# EAGLE design drive-sys-board-rev2 (EAGLE 6.5.0)
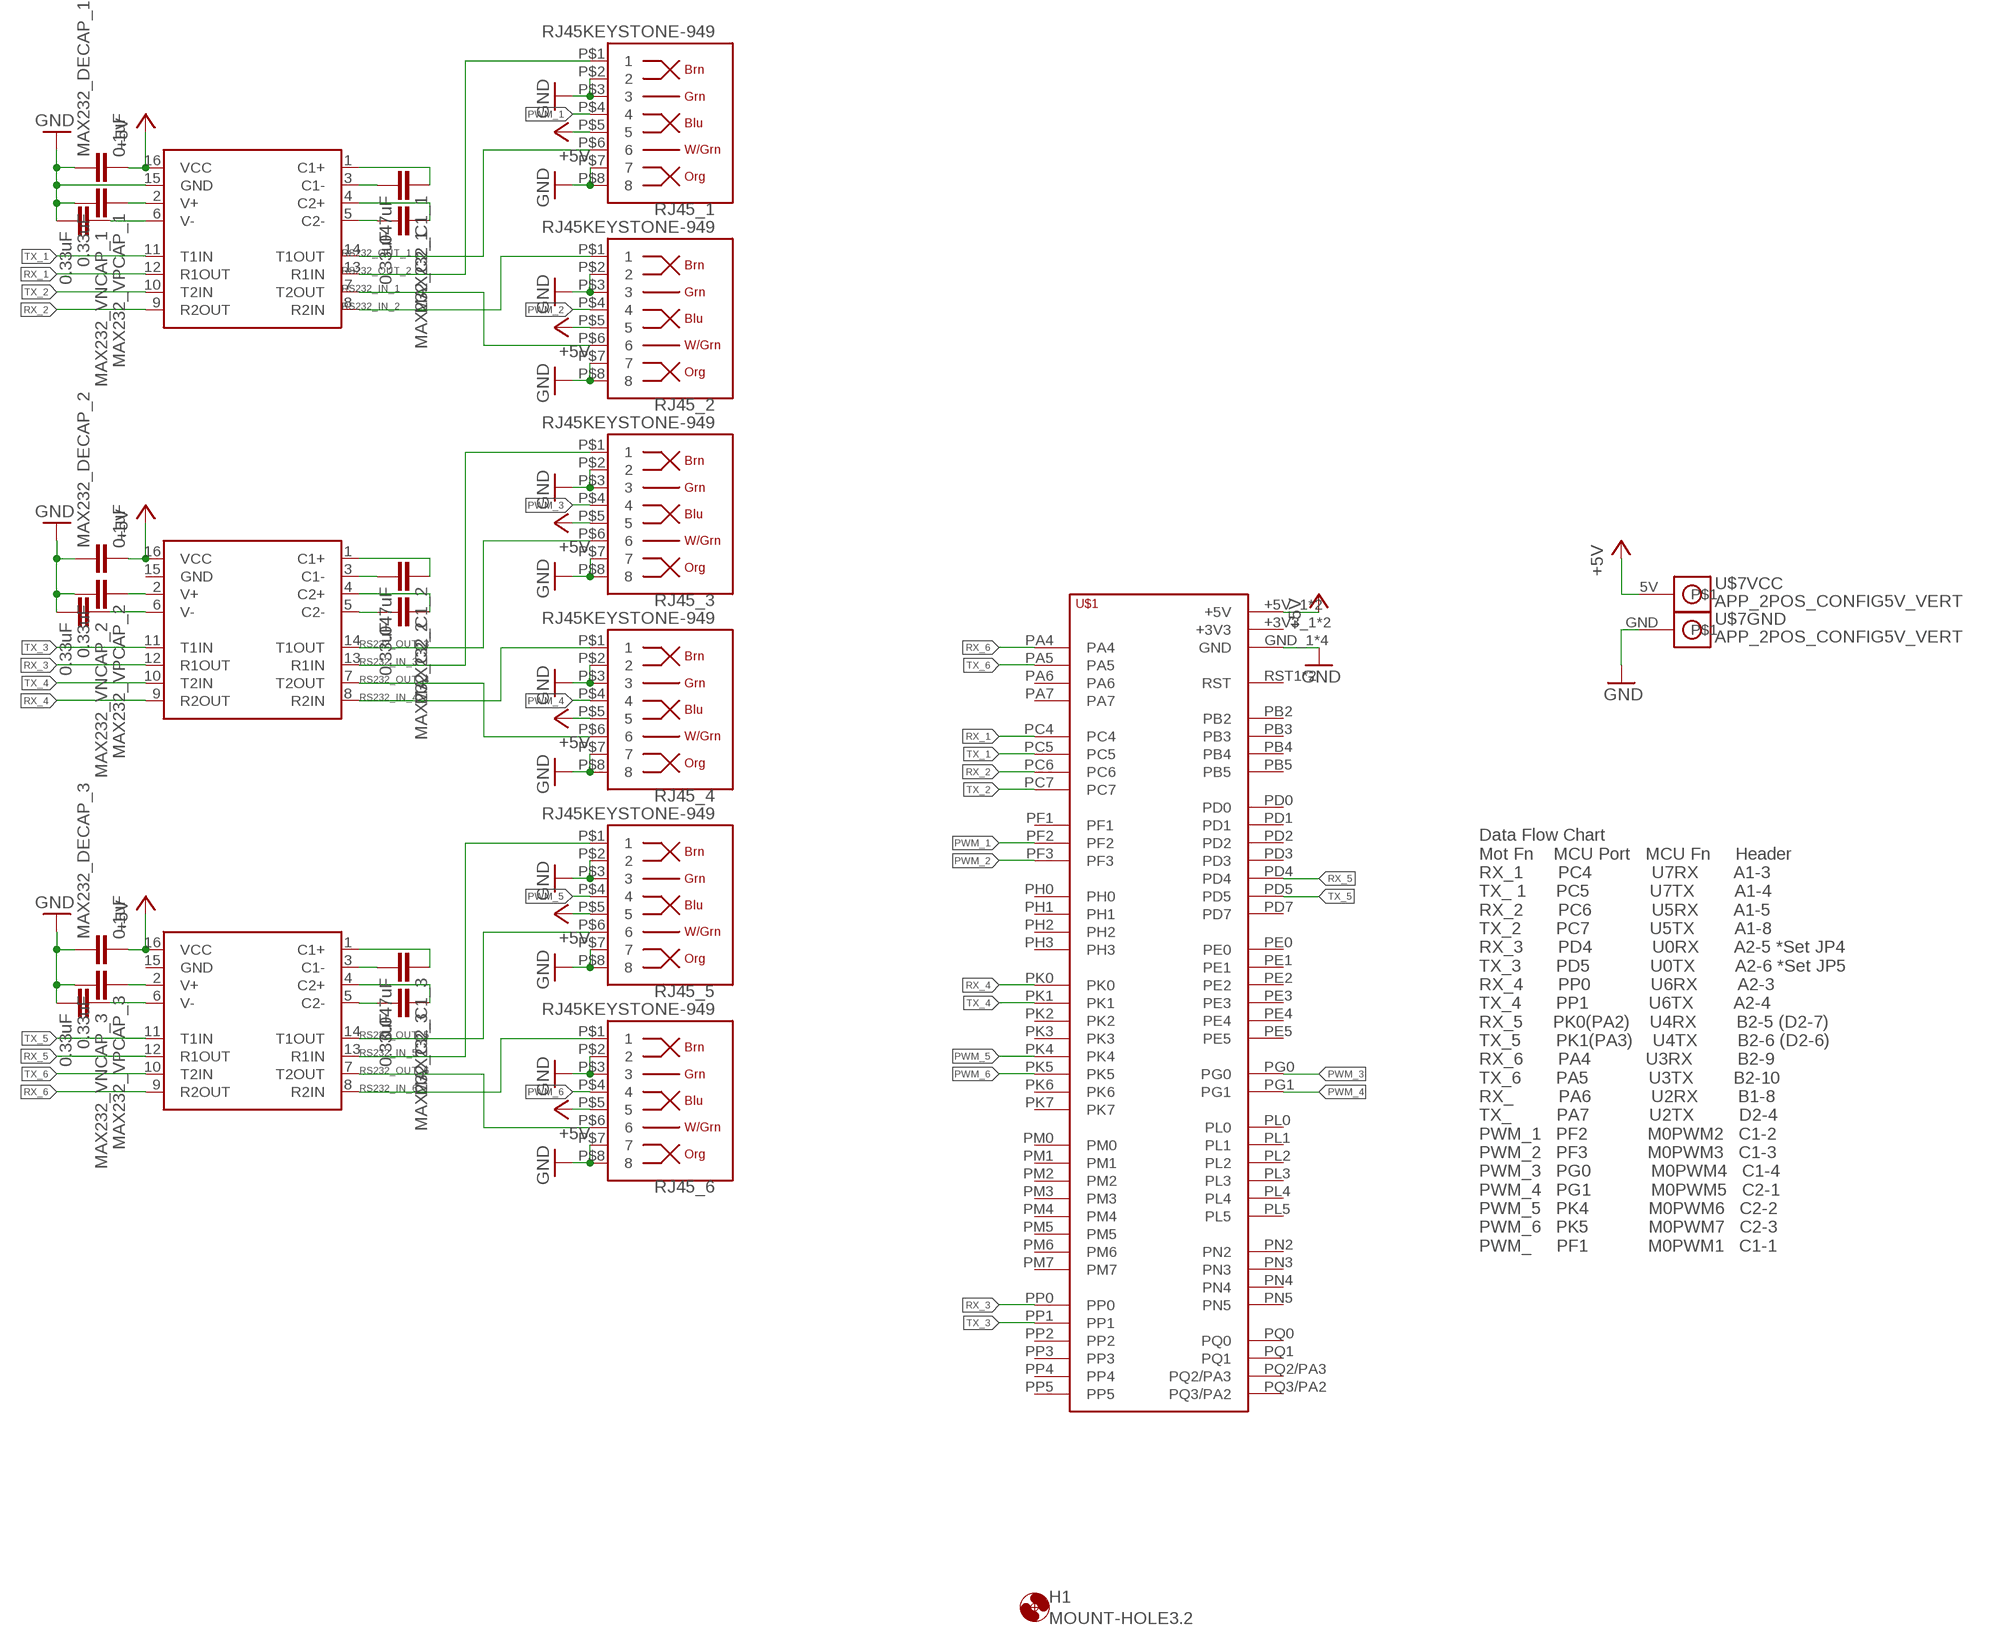
[diagram p0: schematic, sheet 1]

## Parts
H1  MOUNT-HOLE3.2  [3,2]
MAX232_1  MAX3232SO16  [SO16]
MAX232_2  MAX3232SO16  [SO16]
MAX232_3  MAX3232SO16  [SO16]
MAX232_C1_1  .047uF  CAP1206  [1206]
MAX232_C1_2  .047uF  CAP1206  [1206]
MAX232_C1_3  0.047uF  CAP1206  [1206]
MAX232_C2_1  0.33uF  CAP1206  [1206]
MAX232_C2_2  0.33uF  CAP1206  [1206]
MAX232_C2_3  0.33uF  CAP1206  [1206]
MAX232_DECAP_1  0.1uF  CAP1206  [1206]
MAX232_DECAP_2  0.1uF  CAP1206  [1206]
MAX232_DECAP_3  0.1uF  CAP1206  [1206]
MAX232_VNCAP_1  0.33uF  CAP1206  [1206]
MAX232_VNCAP_2  0.33uF  CAP1206  [1206]
MAX232_VNCAP_3  0.33uF  CAP1206  [1206]
MAX232_VPCAP_1  0.33uF  CAP1206  [1206]
MAX232_VPCAP_2  0.33uF  CAP1206  [1206]
MAX232_VPCAP_3  0.33uF  CAP1206  [1206]
RJ45_1  RJ45KEYSTONE-949  [KEYSTONE-949]
RJ45_2  RJ45KEYSTONE-949  [KEYSTONE-949]
RJ45_3  RJ45KEYSTONE-949  [KEYSTONE-949]
RJ45_4  RJ45KEYSTONE-949  [KEYSTONE-949]
RJ45_5  RJ45KEYSTONE-949  [KEYSTONE-949]
RJ45_6  RJ45KEYSTONE-949  [KEYSTONE-949]
U$1  TIVA-C-CONNECTED  [TIVA-C-CONNECTED]
U$7  APP_2POS_CONFIG5V_VERT  [APP45_5V_VERT_CONFIG]

## Nets
+5V: MAX232_1.16(VCC) MAX232_2.16(VCC) MAX232_3.16(VCC) MAX232_DECAP_1.2 MAX232_DECAP_2.2 MAX232_DECAP_3.2 RJ45_1.P$5 RJ45_2.P$5 RJ45_3.P$5 RJ45_4.P$5 RJ45_5.P$5 RJ45_6.P$5 U$1.+5V_1(+5V) U$1.+5V_2(+5V) U$7.5V
GND: MAX232_1.15(GND) MAX232_DECAP_1.1 MAX232_DECAP_2.1 MAX232_DECAP_3.1 MAX232_VNCAP_1.2 MAX232_VNCAP_2.2 MAX232_VNCAP_3.2 MAX232_VPCAP_1.2 MAX232_VPCAP_2.2 MAX232_VPCAP_3.2 RJ45_1.P$2 RJ45_1.P$3 RJ45_1.P$7 RJ45_1.P$8 RJ45_2.P$2 RJ45_2.P$3 RJ45_2.P$7 RJ45_2.P$8 RJ45_3.P$2 RJ45_3.P$3 RJ45_3.P$7 RJ45_3.P$8 RJ45_4.P$2 RJ45_4.P$3 RJ45_4.P$7 RJ45_4.P$8 RJ45_5.P$2 RJ45_5.P$3 RJ45_5.P$7 RJ45_5.P$8 RJ45_6.P$2 RJ45_6.P$3 RJ45_6.P$7 RJ45_6.P$8 U$1.GND_1(GND) U$1.GND_2(GND) U$1.GND_3(GND) U$1.GND_4(GND) U$7.GND
N$1_1: MAX232_1.1(C1+) MAX232_C1_1.1
N$1_2: MAX232_2.1(C1+) MAX232_C1_2.1
N$1_3: MAX232_3.1(C1+) MAX232_C1_3.1
N$2_1: MAX232_1.2(V+) MAX232_VPCAP_1.1
N$2_2: MAX232_2.2(V+) MAX232_VPCAP_2.1
N$2_3: MAX232_3.2(V+) MAX232_VPCAP_3.1
N$3_1: MAX232_1.3(C1-) MAX232_C1_1.2
N$3_2: MAX232_2.3(C1-) MAX232_C1_2.2
N$3_3: MAX232_3.3(C1-) MAX232_C1_3.2
N$4_1: MAX232_1.4(C2+) MAX232_C2_1.1
N$4_2: MAX232_2.4(C2+) MAX232_C2_2.1
N$4_3: MAX232_3.4(C2+) MAX232_C2_3.1
N$5_1: MAX232_1.5(C2-) MAX232_C2_1.2
N$5_2: MAX232_2.5(C2-) MAX232_C2_2.2
N$5_3: MAX232_3.5(C2-) MAX232_C2_3.2
N$6_1: MAX232_1.6(V-) MAX232_VNCAP_1.1
N$6_2: MAX232_2.6(V-) MAX232_VNCAP_2.1
N$6_3: MAX232_3.6(V-) MAX232_VNCAP_3.1
PWM_1: RJ45_1.P$4 U$1.PF2
PWM_2: RJ45_2.P$4 U$1.PF3
PWM_3: RJ45_3.P$4 U$1.PG0
PWM_4: RJ45_4.P$4 U$1.PG1
PWM_5: RJ45_5.P$4 U$1.PK4
PWM_6: RJ45_6.P$4 U$1.PK5
RS232_IN_1: MAX232_1.13(R1IN) RJ45_1.P$1
RS232_IN_2: MAX232_1.8(R2IN) RJ45_2.P$1
RS232_IN_3: MAX232_2.13(R1IN) RJ45_3.P$1
RS232_IN_4: MAX232_2.8(R2IN) RJ45_4.P$1
RS232_IN_5: MAX232_3.13(R1IN) RJ45_5.P$1
RS232_IN_6: MAX232_3.8(R2IN) RJ45_6.P$1
RS232_OUT_1: MAX232_1.14(T1OUT) RJ45_1.P$6
RS232_OUT_2: MAX232_1.7(T2OUT) RJ45_2.P$6
RS232_OUT_3: MAX232_2.14(T1OUT) RJ45_3.P$6
RS232_OUT_4: MAX232_2.7(T2OUT) RJ45_4.P$6
RS232_OUT_5: MAX232_3.14(T1OUT) RJ45_5.P$6
RS232_OUT_6: MAX232_3.7(T2OUT) RJ45_6.P$6
RX_1: MAX232_1.12(R1OUT) U$1.PC4
RX_2: MAX232_1.9(R2OUT) U$1.PC6
RX_3: MAX232_2.12(R1OUT) U$1.PP0
RX_4: MAX232_2.9(R2OUT) U$1.PK0
RX_5: MAX232_3.12(R1OUT) U$1.PD4
RX_6: MAX232_3.9(R2OUT) U$1.PA4
TX_1: MAX232_1.11(T1IN) U$1.PC5
TX_2: MAX232_1.10(T2IN) U$1.PC7
TX_3: MAX232_2.11(T1IN) U$1.PP1
TX_4: MAX232_2.10(T2IN) U$1.PK1
TX_5: MAX232_3.11(T1IN) U$1.PD5
TX_6: MAX232_3.10(T2IN) U$1.PA5
Unconnected: MAX232_2.15(GND) MAX232_3.15(GND) U$1.+3V3_1(+3V3) U$1.+3V3_2(+3V3) U$1.PA6 U$1.PA7 U$1.PB2 U$1.PB3 U$1.PB4 U$1.PB5 U$1.PD0 U$1.PD1 U$1.PD2 U$1.PD3 U$1.PD7 U$1.PE0 U$1.PE1 U$1.PE2 U$1.PE3 U$1.PE4 U$1.PE5 U$1.PF1 U$1.PH0 U$1.PH1 U$1.PH2 U$1.PH3 U$1.PK2 U$1.PK3 U$1.PK6 U$1.PK7 U$1.PL0 U$1.PL1 U$1.PL2 U$1.PL3 U$1.PL4 U$1.PL5 U$1.PM0 U$1.PM1 U$1.PM2 U$1.PM3 U$1.PM4 U$1.PM5 U$1.PM6 U$1.PM7 U$1.PN2 U$1.PN3 U$1.PN4 U$1.PN5 U$1.PP2 U$1.PP3 U$1.PP4 U$1.PP5 U$1.PQ0 U$1.PQ1 U$1.PQ2/PA3 U$1.PQ3/PA2 U$1.RST1(RST) U$1.RST_2(RST)

## Notes on the sheet
- Data Flow Chart
  Mot Fn    MCU Port   MCU Fn     Header
  RX_1       PC4            U7RX       A1-3
  TX_ 1      PC5            U7TX        A1-4
  RX_2       PC6            U5RX       A1-5
  TX_2       PC7            U5TX        A1-8
  RX_3       PD4            U0RX       A2-5 *Set JP4
  TX_3       PD5            U0TX        A2-6 *Set JP5
  RX_4       PP0            U6RX        A2-3 
  TX_4       PP1            U6TX        A2-4
  RX_5      PK0(PA2)    U4RX        B2-5 (D2-7)
  TX_5       PK1(PA3)    U4TX        B2-6 (D2-6)
  RX_6       PA4           U3RX         B2-9
  TX_6       PA5            U3TX        B2-10
  RX_         PA6            U2RX        B1-8
  TX_         PA7            U2TX         D2-4
  PWM_1   PF2            M0PWM2   C1-2
  PWM_2   PF3            M0PWM3   C1-3
  PWM_3   PG0            M0PWM4   C1-4
  PWM_4   PG1            M0PWM5   C2-1
  PWM_5   PK4            M0PWM6   C2-2
  PWM_6   PK5            M0PWM7   C2-3
  PWM_     PF1            M0PWM1   C1-1

## Library data of the parts
H1 = holes:MOUNT-HOLE: MOUNTING HOLE with drill center marker
MAX232_1-MAX232_3 = MRDT-Digital-ICs:MAX3232: MAX3232 RS232 Transceiver http://pdfserv.maximintegrated.com/en/ds/MAX3222-MAX3241.pdf
MAX232_C1_1-MAX232_C1_3 MAX232_C2_1-MAX232_C2_3 MAX232_DECAP_1-MAX232_DECAP_3 MAX232_VNCAP_1-MAX232_VNCAP_3 MAX232_VPCAP_1-MAX232_VPCAP_3 = SparkFun-Capacitors:CAP: Capacitor Standard 0603 ceramic capacitor, and 0.1" leaded capacitor.
RJ45_1-RJ45_6 = MRDT-2015-General:RJ45
U$1 = MRDT-2015-General:TIVA-C-CONNECTED: TIVA C CONNECTED LAUNCHPAD
U$7 = MRDT-Connectors:APP_2POS_CONFIG; COLOR1: RED; COLOR2: BLACK

## Board
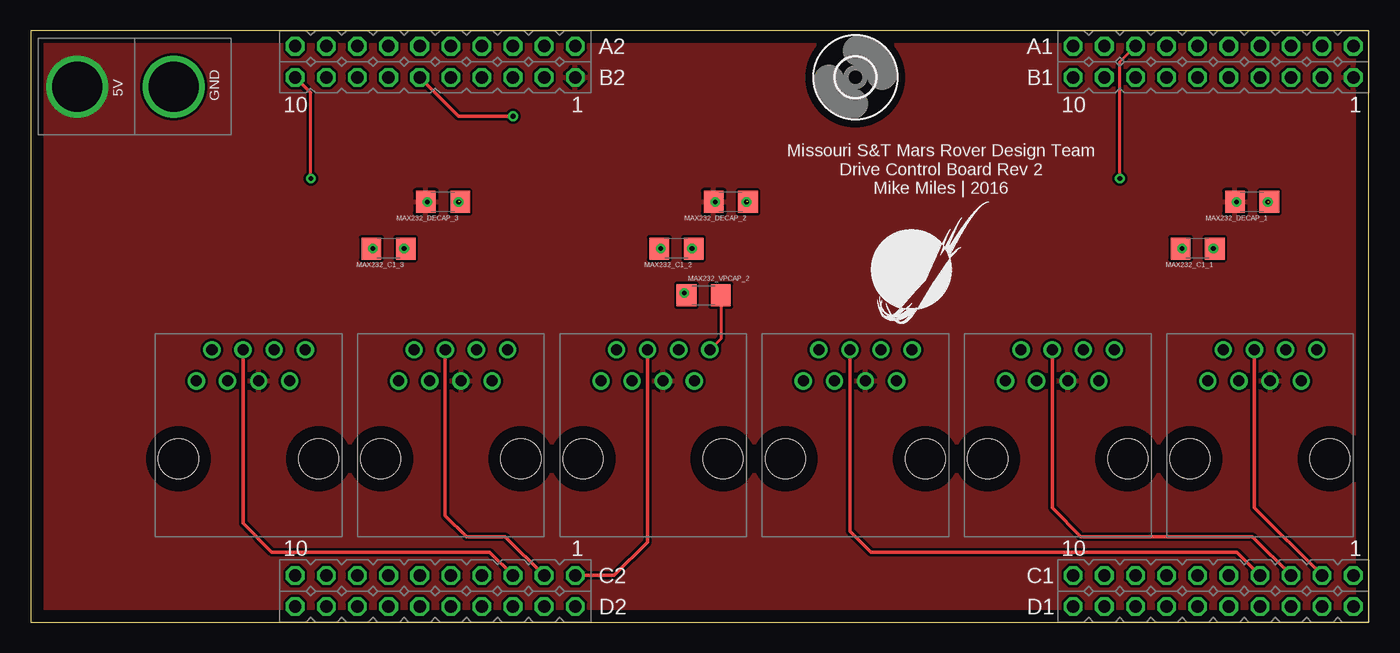
[diagram p1: board, top side]
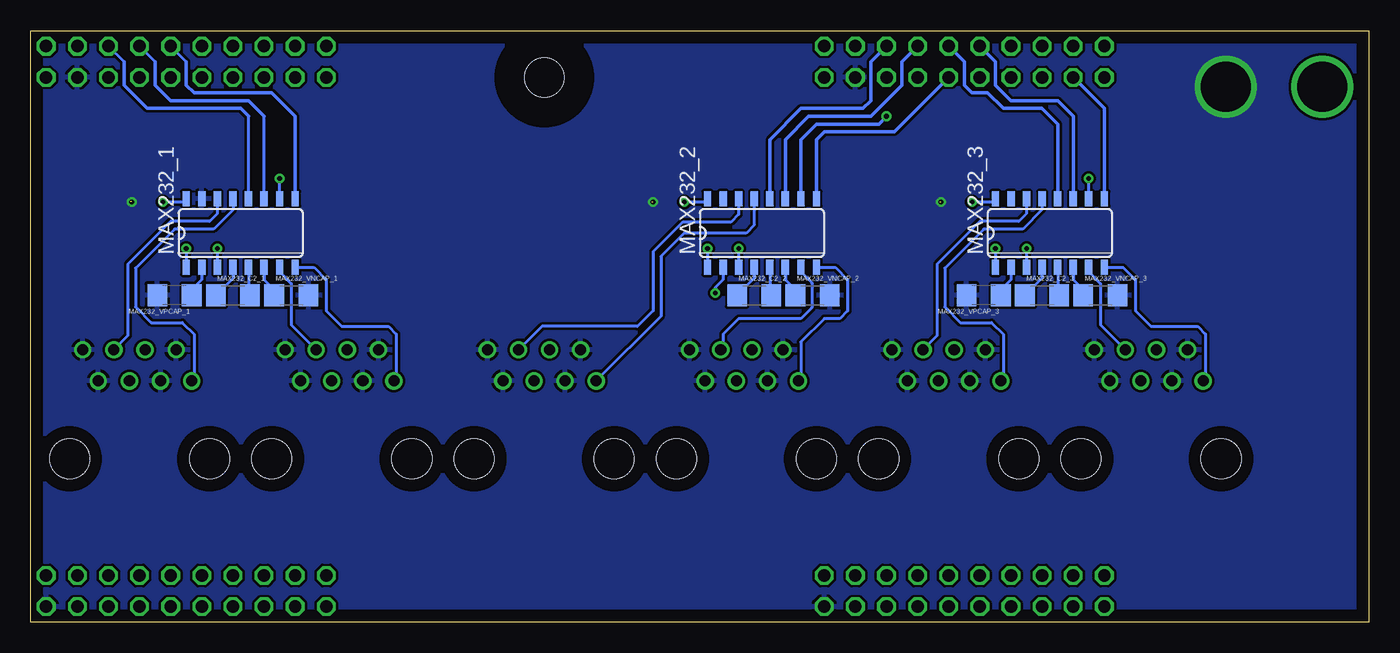
[diagram p2: board, bottom side, seen from below]

Size 109.22 x 48.26 mm. Coordinates in mm from the lower left corner, seen from the top.
Outline: 0,0 109.22,0 109.22,48.26 0,48.26 0,0
Copper layers (1*16): Top 0.035mm / dielectric 1.5mm / Bottom 0.035mm
Design rules "default *": minimum track width 10mil, minimum drill 15mil, track to track 8mil, track to pad 8mil, pad to pad 8mil, via to via 8mil, smd to smd 8mil, copper to edge 40mil, drill to drill 8mil, minimum pad ring 10mil, minimum via ring 8mil, stop-mask expansion 4mil, vias tented up to drill 0mil, thermal gap 10mil

### Footprints (pad centres in the part's own frame; a part is rotated, then mirrored left to right if it is on the bottom)
3,2 = hole 3.2: 0,0
SO16 = smd 0.6 x 1.2: 1 -4.445,-2.8; 2 -3.175,-2.8; 3 -1.905,-2.8; 4 -0.635,-2.8; 5 0.635,-2.8; 6 1.905,-2.8; 7 3.175,-2.8; 8 4.445,-2.8; 9 4.445,2.8; 10 3.175,2.8; 11 1.905,2.8; 12 0.635,2.8; 13 -0.635,2.8; 14 -1.905,2.8; 15 -3.175,2.8; 16 -4.445,2.8
1206 = smd 1.6 x 1.8: 1 -1.4,0; 2 1.4,0
KEYSTONE-949 = drill 0.9: P$1 1.46,6.35; P$2 2.731,8.89; P$3 4,6.35; P$4 5.271,8.89; P$5 6.54,6.35; P$6 7.811,8.89; P$7 9.081,6.35; P$8 10.351,8.89 | hole 3.251: 0,0; 11.43,0
TIVA-C-CONNECTED = drill 1.016 octagon: +3V3_1 59.69,54.61; +3V3_2 123.19,54.61; +5V_1 59.69,52.07; +5V_2 123.19,52.07; GND_1 57.15,52.07; GND_2 59.69,8.89; GND_3 120.65,52.07; GND_4 123.19,8.89; PA4 39.37,52.07; PA5 36.83,52.07; PA6 105.41,52.07; PA7 52.07,8.89; PB2 102.87,54.61; PB3 100.33,54.61; PB4 54.61,52.07; PB5 52.07,52.07; PC4 118.11,54.61; PC5 115.57,54.61; PC6 113.03,54.61; PC7 105.41,54.61; PD0 107.95,8.89; PD1 110.49,8.89; PD2 57.15,54.61; PD3 107.95,54.61; PD4 49.53,54.61; PD5 46.99,54.61; PD7 107.95,52.07; PE0 118.11,52.07; PE1 115.57,52.07; PE2 113.03,52.07; PE3 110.49,52.07; PE4 120.65,54.61; PE5 110.49,54.61; PF1 123.19,11.43; PF2 120.65,11.43; PF3 118.11,11.43; PG0 115.57,11.43; PG1 59.69,11.43; PH0 44.45,11.43; PH1 41.91,11.43; PH2 118.11,8.89; PH3 115.57,8.89; PK0 49.53,52.07; PK1 46.99,52.07; PK2 44.45,52.07; PK3 41.91,52.07; PK4 57.15,11.43; PK5 54.61,11.43; PK6 39.37,11.43; PK7 36.83,11.43; PL0 107.95,11.43; PL1 105.41,11.43; PL2 102.87,11.43; PL3 100.33,11.43; PL4 113.03,11.43; PL5 110.49,11.43; PM0 52.07,11.43; PM1 49.53,11.43; PM2 46.99,11.43; PM3 120.65,8.89; PM4 102.87,52.07; PM5 100.33,52.07; PM6 36.83,8.89; PM7 57.15,8.89; PN2 105.41,8.89; PN3 102.87,8.89; PN4 36.83,54.61; PN5 39.37,54.61; PP0 54.61,54.61; PP1 52.07,54.61; PP2 100.33,8.89; PP3 41.91,8.89; PP4 41.91,54.61; PP5 54.61,8.89; PQ0 44.45,54.61; PQ1 39.37,8.89; PQ2/PA3 46.99,8.89; PQ3/PA2 44.45,8.89; RST1 49.53,8.89; RST_2 113.03,8.89
APP45_5V_VERT_CONFIG = drill 4.064: 5V 3.937,12.573; GND 3.937,4.699

### Placement (x,y rotation side)
H1  67.31,44.45 0 top
MAX232_1  92.08,31.75 0 bottom
MAX232_2  49.53,31.75 0 bottom
MAX232_3  26.04,31.75 0 bottom
MAX232_C1_1  95.25,30.48 180 top
MAX232_C1_2  52.7,30.48 180 top
MAX232_C1_3  29.21,30.48 180 top
MAX232_C2_1  92.71,26.67 0 bottom
MAX232_C2_2  50.16,26.67 0 bottom
MAX232_C2_3  26.67,26.67 0 bottom
MAX232_DECAP_1  99.69,34.29 180 top
MAX232_DECAP_2  57.15,34.29 180 top
MAX232_DECAP_3  33.66,34.29 180 top
MAX232_VNCAP_1  87.95,26.67 0 bottom
MAX232_VNCAP_2  45.4,26.67 0 bottom
MAX232_VNCAP_3  21.91,26.67 0 bottom
MAX232_VPCAP_1  97.47,26.67 180 bottom
MAX232_VPCAP_2  54.93,26.67 0 top
MAX232_VPCAP_3  31.43,26.67 180 bottom
RJ45_1  94.61,13.34 0 top
RJ45_2  78.11,13.34 0 top
RJ45_3  61.59,13.34 0 top
RJ45_4  45.09,13.34 0 top
RJ45_5  28.57,13.34 0 top
RJ45_6  12.06,13.34 0 top
U$1  -15.24,-7.62 0 top
U$2  [MRDT_LOGO]  68.58,23.5 0 top
U$7  16.38,39.75 90 top

### Tracks (layer width: path | path; a pad name or v marks a point on that pad's centre or on a via)
+5V  (via drill 0.38)
  Top 0.254: MAX232_DECAP_1.2 v98.42,34.29 | MAX232_DECAP_2.2 v55.88,34.29 | MAX232_DECAP_3.2 v32.38,34.29
  Bottom 0.254: v98.42,34.29 96.78,34.29 MAX232_1.16 | v55.88,34.29 54.23,34.29 MAX232_2.16 | v32.38,34.29 30.74,34.29 MAX232_3.16
  pour Top: -1.27,52.7 -1.27,-1.27 116.2,-1.27 116.2,52.7
GND  (via drill 0.38)  (3 unrouted)
  Top 0.254: MAX232_VPCAP_2.2 56.33,23.12 RJ45_4.P$8
  other vias: 100.97,34.29 58.42,34.29 34.92,34.29
  pour Bottom: -5.08,49.53 -5.08,-3.81 111.12,-4.45 111.12,49.53
N$1  (via drill 0.38)
  other vias: 98.42,34.29
N$1_1  (via drill 0.38)
  Top 0.254: MAX232_C1_1.1 v96.52,30.48
  Bottom 0.254: v96.52,30.48 MAX232_1.1
N$1_2  (via drill 0.38)
  Top 0.254: MAX232_C1_2.1 v53.98,30.48
  Bottom 0.254: v53.98,30.48 MAX232_2.1
N$1_3  (via drill 0.38)
  Top 0.254: MAX232_C1_3.1 v30.48,30.48
  Bottom 0.254: v30.48,30.48 MAX232_3.1
N$2_1
  Bottom 0.254: MAX232_1.2 95.25,27.94 95.89,27.3 95.89,26.86 MAX232_VPCAP_1.1
N$2_2  (via drill 0.38)
  Top 0.254: v53.34,26.86 MAX232_VPCAP_2.1
  Bottom 0.254: MAX232_2.2 52.7,27.94 53.34,27.3 v53.34,26.86
N$2_3
  Bottom 0.254: MAX232_3.2 29.21,27.94 29.84,27.3 29.84,26.86 MAX232_VPCAP_3.1
N$3  (via drill 0.38)
  other vias: 32.38,34.29
N$3_1  (via drill 0.38)
  Top 0.254: MAX232_C1_1.2 v93.98,30.48
  Bottom 0.254: v93.98,30.48 MAX232_1.3
N$3_2  (via drill 0.38)
  Top 0.254: MAX232_C1_2.2 v51.44,30.48
  Bottom 0.254: v51.44,30.48 MAX232_2.3
N$3_3  (via drill 0.38)
  Top 0.254: MAX232_C1_3.2 v27.94,30.48
  Bottom 0.254: v27.94,30.48 MAX232_3.3
N$4_1
  Bottom 0.254: MAX232_1.4 92.71,28.07 MAX232_C2_1.1
N$4_2
  Bottom 0.254: MAX232_2.4 50.16,28.07 MAX232_C2_2.1
N$4_3
  Bottom 0.254: MAX232_3.4 26.67,28.07 MAX232_C2_3.1
N$5_1
  Bottom 0.254: MAX232_1.5 91.44,26.8 MAX232_C2_1.2
N$5_2
  Bottom 0.254: MAX232_2.5 48.9,26.8 MAX232_C2_2.2
N$5_3
  Bottom 0.254: MAX232_3.5 25.4,26.8 MAX232_C2_3.2
N$6_1
  Bottom 0.254: MAX232_1.6 90.17,27.94 89.53,27.3 89.53,26.86 MAX232_VNCAP_1.1
N$6_2
  Bottom 0.254: MAX232_2.6 47.62,27.94 46.99,27.3 46.99,26.86 MAX232_VNCAP_2.1
N$6_3
  Bottom 0.254: MAX232_3.6 24.13,27.94 23.5,27.3 23.5,26.86 MAX232_VNCAP_3.1
PWM_1
  Top 0.305: U$1.PF2 99.89,9.34 RJ45_1.P$4
PWM_2
  Top 0.305: U$1.PF3 99.69,6.99 85.72,6.99 83.38,9.34 RJ45_2.P$4
PWM_3
  Top 0.305: U$1.PG0 98.42,5.71 68.58,5.71 66.86,7.43 RJ45_3.P$4
PWM_4
  Top 0.305: U$1.PG1 47.62,3.81 50.35,6.54 RJ45_4.P$4
PWM_5
  Top 0.305: U$1.PK4 38.73,6.99 35.56,6.99 33.85,8.7 RJ45_5.P$4
PWM_6
  Top 0.305: U$1.PK5 37.47,5.71 19.68,5.71 17.34,8.06 RJ45_6.P$4
RS232_IN_1
  Bottom 0.254: MAX232_1.13 92.71,33.66 94.3,32.07 97.47,32.07 100.65,28.89 100.65,25.72 99.38,24.45 96.84,24.45 95.89,23.5 95.89,19.88 RJ45_1.P$1
RS232_IN_2
  Bottom 0.254: MAX232_1.8 86.1,28.95 85.09,27.94 85.09,25.4 83.82,24.13 80.01,24.13 79.38,23.5 79.38,19.88 RJ45_2.P$1
RS232_IN_3
  Bottom 0.254: MAX232_2.13 50.16,32.38 50.8,31.75 55.88,31.75 57.78,29.84 57.78,24.96 RJ45_3.P$1
RS232_IN_4
  Bottom 0.254: MAX232_2.8 43.55,28.95 42.55,27.94 42.55,25.4 43.18,24.77 44.45,24.77 46.35,22.86 46.35,19.88 RJ45_4.P$1
RS232_IN_5
  Bottom 0.254: MAX232_3.13 26.67,33.66 28.26,32.07 31.43,32.07 34.61,28.89 34.61,25.72 33.34,24.45 30.8,24.45 29.84,23.5 29.84,19.88 RJ45_5.P$1
RS232_IN_6
  Bottom 0.254: MAX232_3.8 20.06,28.95 19.05,27.94 19.05,25.4 17.78,24.13 13.97,24.13 13.34,23.5 13.34,19.88 RJ45_6.P$1
RS232_OUT_1
  Bottom 0.254: MAX232_1.14 93.98,33.34 94.61,32.7 97.79,32.7 101.28,29.21 101.28,23.37 RJ45_1.P$6
RS232_OUT_2
  Bottom 0.254: MAX232_1.7 88.9,28.57 87.95,27.62 87.95,24.26 RJ45_2.P$6
RS232_OUT_3
  Bottom 0.254: MAX232_2.14 51.44,33.27 52.07,32.64 56.01,32.64 58.42,30.23 58.42,25.4 59.69,24.13 67.5,24.13 RJ45_3.P$6
RS232_OUT_4
  Bottom 0.254: MAX232_2.7 46.35,28.57 45.47,27.69 45.47,25.65 46.35,24.77 51.44,24.77 52.7,23.5 52.7,22.42 RJ45_4.P$6
RS232_OUT_5
  Bottom 0.254: MAX232_3.14 27.94,33.34 28.57,32.7 31.75,32.7 35.24,29.21 35.24,23.37 RJ45_5.P$6
RS232_OUT_6
  Bottom 0.254: MAX232_3.7 22.86,28.57 21.91,27.62 21.91,24.26 RJ45_6.P$6
RX_1
  Bottom 0.254: MAX232_1.12 91.44,41.27 | 101.6,45.72 U$1.PC4
  Bottom 0.305: 91.44,41.27 92.08,41.91 99.69,41.91 101.6,43.81 101.6,45.72
RX_2
  Bottom 0.254: 96.52,45.72 U$1.PC6
  Bottom 0.305: MAX232_1.9 87.63,41.27 89.53,43.18 95.89,43.18 96.52,43.81 96.52,45.72
RX_3
  Bottom 0.305: MAX232_2.12 48.9,39.37 46.35,41.91 41.27,41.91 40.64,42.55 40.64,45.72 U$1.PP0
RX_4
  Bottom 0.305: MAX232_2.9 45.09,39.37 44.45,40.01 38.73,40.01 U$1.PK0
RX_5
  Bottom 0.305: MAX232_3.12 25.4,40.64 26.67,41.91 29.84,41.91 31.11,43.18 32.38,43.18 33.02,43.81 33.02,45.72 U$1.PD4
RX_6
  Bottom 0.305: MAX232_3.9 21.59,41.91 U$1.PA4
TX_1
  Bottom 0.254: MAX232_1.11 90.17,41.27 | 99.06,45.72 U$1.PC5
  Bottom 0.305: 90.17,41.27 91.44,42.55 97.79,42.55 99.06,43.81 99.06,45.72
TX_2  (via drill 0.38)
  Top 0.254: v88.9,36.2 88.9,45.72 U$1.PC7
  Bottom 0.254: MAX232_1.10 v88.9,36.2
TX_3
  Bottom 0.305: MAX232_2.11 47.62,39.37 45.72,41.27 40.64,41.27 38.1,43.81 38.1,45.72 U$1.PP1
TX_4  (via drill 0.38)
  Top 0.305: v39.37,41.27 34.92,41.27 U$1.PK1
  Bottom 0.305: MAX232_2.10 46.35,39.37 45.09,40.64 40.01,40.64 v39.37,41.27
TX_5
  Bottom 0.305: MAX232_3.11 24.13,41.27 25.4,42.55 29.21,42.55 30.48,43.81 30.48,45.72 U$1.PD5
TX_6  (via drill 0.38)
  Top 0.254: v22.86,36.2 22.86,43.18
  Top 0.305: 22.86,43.18 U$1.PA5
  Bottom 0.254: MAX232_3.10 v22.86,36.2

### Text on the board
tPlace: Missouri S&T Mars Rover Design Team / Drive Control Board Rev 2 / Mike Miles | 2016